# Altium schematic sheet eMMC.SchDoc: eMMC
size 420 x 297 mm; CompanyName: STMicroelectronics; Organization: Microcontrollers Division; DocumentNumber: 1; SheetNumber: 10; SheetTotal: 19
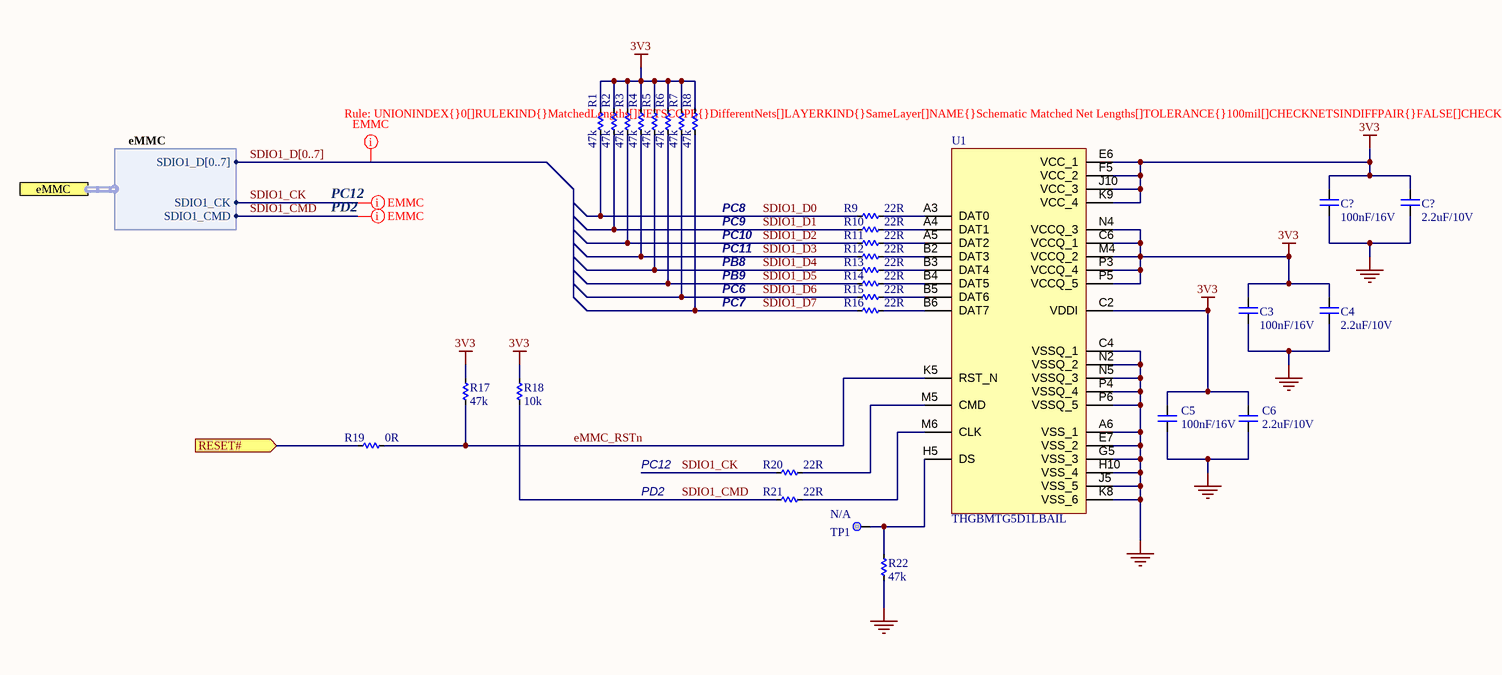
[diagram p0: eMMC.SchDoc]

## Parts
(Parts that share a designator on the sheet are numbered #1, #2 ... from top to bottom, then left to right.)
C3  100nF/16V  [CAP_C_1608X80]
C4  2.2uF/10V  [CAP_C_1608X80]
C5  100nF/16V  [CAP_C_1608X80]
C6  2.2uF/10V  [CAP_C_1608X80]
C?#1  100nF/16V  [CAP_C_1608X80]
C?#2  2.2uF/10V  [CAP_C_1608X80]
R1  47k  [RES_C_1608X60]
R2  47k  [RES_C_1608X60]
R3  47k  [RES_C_1608X60]
R4  47k  [RES_C_1608X60]
R5  47k  [RES_C_1608X60]
R6  47k  [RES_C_1608X60]
R7  47k  [RES_C_1608X60]
R8  47k  [RES_C_1608X60]
R9  22R  [RES_C_1608X60]
R10  22R  [RES_C_1608X60]
R11  22R  [RES_C_1608X60]
R12  22R  [RES_C_1608X60]
R13  22R  [RES_C_1608X60]
R14  22R  [RES_C_1608X60]
R15  22R  [RES_C_1608X60]
R16  22R  [RES_C_1608X60]
R17  47k  [RES_C_1608X60]
R18  10k  [RES_C_1608X60]
R19  0R  [RES_C_1608X60]
R20  22R  [RES_C_1608X60]
R21  22R  [RES_C_1608X60]
R22  47k  [RES_C_1608X60]
TP1  Test Point  [TESTPOINT]  (value not drawn)  (no BOM)
U1  THGBMTG5D1LBAIL  [BGA153C50P14X14_1150X1300X80]

## Ports
eMMC (harness eMMC), RESET# (in)

## Harnesses
eMMC: SDIO1_D[0..7], SDIO1_CMD, SDIO1_CK

## Nets
3V3: C3.2 C4.2 C5.2 C6.2 C?#1.2 C?#2.2 R1.2 R2.2 R3.2 R4.2 R5.2 R6.2 R7.2 R8.2 R17.2 R18.2 U1.C2(VDDI) U1.C6(VCCQ_1) U1.E6(VCC_1) U1.F5(VCC_2) U1.J10(VCC_3) U1.K9(VCC_4) U1.M4(VCCQ_2) U1.N4(VCCQ_3) U1.P3(VCCQ_4) U1.P5(VCCQ_5)
GND: C3.1 C4.1 C5.1 C6.1 C?#1.1 C?#2.1 R22.1 U1.A6(VSS_1) U1.C4(VSSQ_1) U1.E7(VSS_2) U1.G5(VSS_3) U1.H10(VSS_4) U1.J5(VSS_5) U1.K8(VSS_6) U1.N2(VSSQ_2) U1.N5(VSSQ_3) U1.P4(VSSQ_4) U1.P6(VSSQ_5)
eMMC_RSTn: R17.1 R19.1 U1.K5(RST_N)
RESET#: R19.2 ; port RESET#
SDIO1_CK: R20.1 ; port eMMC.SDIO1_CK
SDIO1_CMD: R18.1 R21.1 ; port eMMC.SDIO1_CMD
SDIO1_D0: R1.1 R9.1
SDIO1_D1: R2.1 R10.1
SDIO1_D2: R3.1 R11.1
SDIO1_D3: R4.1 R12.1
SDIO1_D4: R5.1 R13.1
SDIO1_D5: R6.1 R14.1
SDIO1_D6: R7.1 R15.1
SDIO1_D7: R8.1 R16.1
NetR9_2: R9.2 U1.A3(DAT0)
NetR10_2: R10.2 U1.A4(DAT1)
NetR11_2: R11.2 U1.A5(DAT2)
NetR12_2: R12.2 U1.B2(DAT3)
NetR13_2: R13.2 U1.B3(DAT4)
NetR14_2: R14.2 U1.B4(DAT5)
NetR15_2: R15.2 U1.B5(DAT6)
NetR16_2: R16.2 U1.B6(DAT7)
NetR20_2: R20.2 U1.M5(CMD)
NetR21_2: R21.2 U1.M6(CLK)
NetR22_2: R22.2 TP1.1 U1.H5(DS)

## Buses and harness runs
bus SDIO1_D[0..7]

## Layout directives
rule Matched Net Lengths [Tolerance = 100mil]: (no net found under the mark), SDIO1_CK, SDIO1_CMD

## Notes on the sheet
- PC12
- PD2
- PC8
- PC9
- PC10
- PC11
- PC6
- PC7
- PB8
- PB9
- Sub-system:
- Design by:
- Sheet title:
- Project:
- Sheet:
- of
- Checked by:
- Approved by:
- Doc no:
- Revision:
- Size:
- Date:

## Library data of the parts
C3-C6 C?#1 C?#2 = CAP_SMD: CAP_Chip; Value: 33pF
R1-R22 = _RES_B_2: RES
TP1 = MCD-00630: Test Point 0.3mm; Part_Type: Misc; Part_Preference: Recommended; Initial_Board_Reference: MB1264; ID: 3115; ShowFields: YES; Component_Country_Of_Origin: Unknown; Internal_Part_Number: MCD-00630; Status: Released; ECCN_US: n/a; ECCN_EU: n/a; Provided_By: n/a; Manufacturer: N/A; Manufacturer_Part_Number: N/A; Order_Code_Digikey: N/A; Order_Code_Farnell: N/A; Order_Code_RS: N/A; Value: N/A; ComponentLink1URL: http://tunmcdsvn.tun.st.com/Component_Documentation_Library/Trunk; Manufacturer_HQ_COO: Unknown
U1 = THGBMTG5D1LBAIL: NAND Flash Serial e-MMC 3.3V 32G-bit 32G/8G/4G x 1/4-bit/8-bit 13.7ns 153-Pin WFBGA; Manufacturer_Name: KIOXIA Corporation; Geometry.Height: 0.8mm; Manufacturer_Part_Number: THGBMTG5D1LBAIL; Mouser Part Number: 757-THGBMTG5D1LBAIL; Mouser Price/Stock: https://www.mouser.co.uk/ProductDetail/Kioxia-America/THGBMTG5D1LBAIL?qs=Znm5pLBrcAKPRFVhV%252B0AbQ%3D%3D; Arrow Part Number: THGBMTG5D1LBAIL; Arrow Price/Stock: null?region=nac; Datasheet Link: https://static6.arrow.com/aropdfconversion/5b79d7e5222d5200711a0ed1082b7aa51b6d9eb4/xia_thgbmtg5d1lbail15nm4gbe-mmcver5.0_e_rev.1.0_20211007.pdf